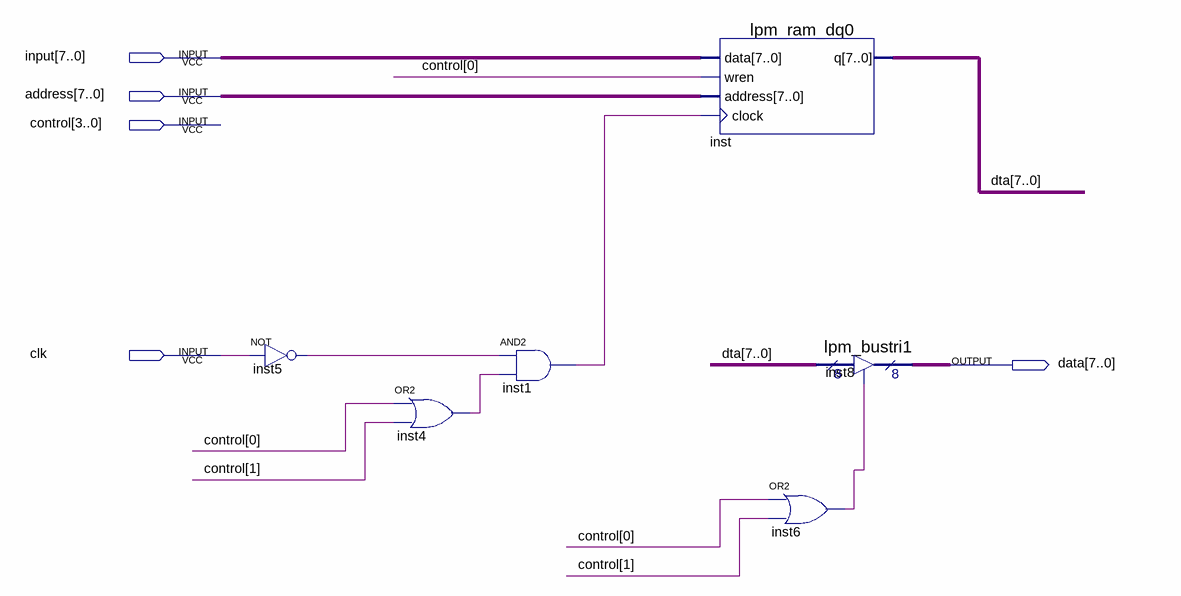
[diagram p0: schematic sheet]
// Quartus schematic RAM.bdf as structural Verilog: 6 symbols, 5 pins
module RAM (
  input  [7:0] \input ,
  input  [7:0] address,
  input  [3:0] control,
  input  clk,
  output [7:0] data
);

  wire inst1_out, inst4_out, inst5_out, inst6_out;
  wire [7:0] dta;

  not inst5 (inst5_out, clk);
  or inst4 (inst4_out, control[0], control[1]);
  and inst1 (inst1_out, inst5_out, inst4_out);
  lpm_ram_dq0 inst (.data(\input ), .wren(control[0]), .address(address), .clock(inst1_out), .q(dta));
  or inst6 (inst6_out, control[0], control[1]);
  lpm_bustri1 inst8 (.enabledt(inst6_out), .data(dta), .tridata(data));
endmodule
